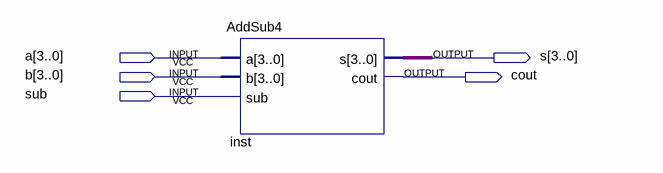
[diagram p0: schematic sheet]
// Quartus schematic AdderDemo.bdf as structural Verilog: 1 symbols, 5 pins
module AdderDemo (
  input  [3:0] a,
  input  [3:0] b,
  input  sub,
  output [3:0] s,
  output cout
);

  AddSub4 inst (.a(a), .b(b), .sub(sub), .s(s), .cout(cout));
endmodule
